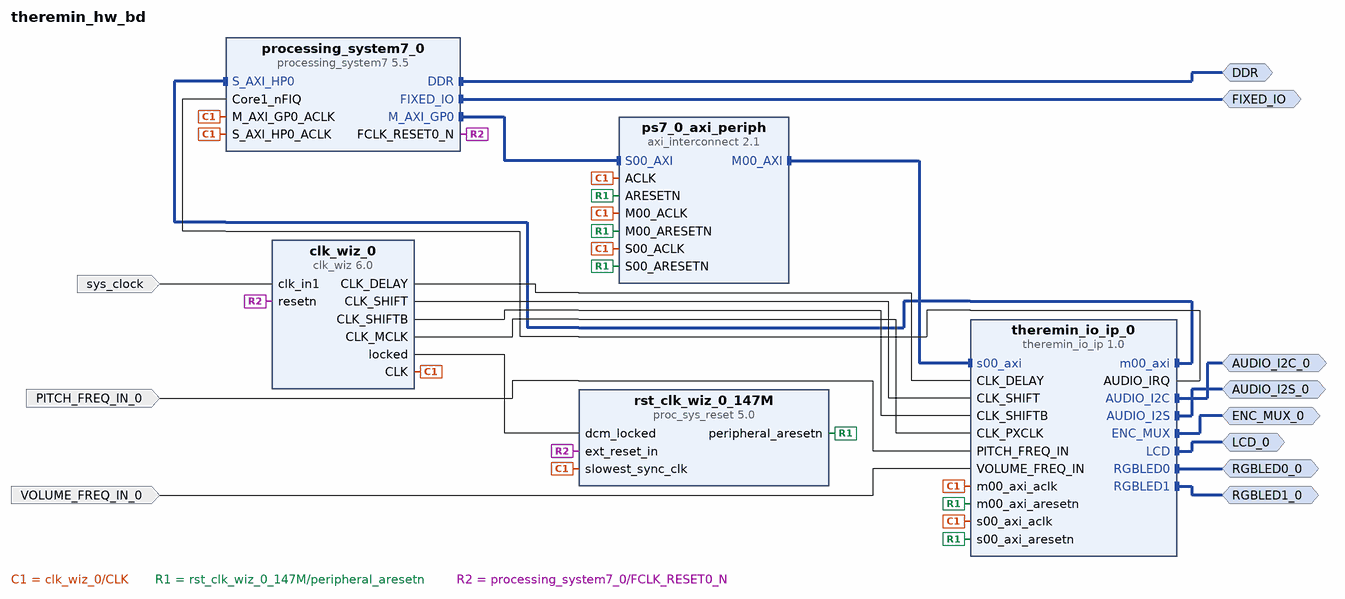
[diagram p0: block diagram of the top level]
# Vivado block design theremin_hw_bd, xc7z010clg400-1, Vivado 2019.1.1
create_bd_design theremin_hw_bd

create_bd_intf_port -mode Master -vlnv xilinx.com:interface:ddrx_rtl:1.0 DDR
create_bd_intf_port -mode Master -vlnv xilinx.com:display_processing_system7:fixedio_rtl:1.0 FIXED_IO
create_bd_intf_port -mode Master -vlnv coolreader.org:user:i2c_rtl:1.0 AUDIO_I2C_0
create_bd_intf_port -mode Master -vlnv coolreader.org:user:input_pin_mux_rtl:1.0 ENC_MUX_0
create_bd_intf_port -mode Master -vlnv coolreader.org:user:lcd_rgb_12bit_rtl:1.0 LCD_0
create_bd_intf_port -mode Master -vlnv coolreader.org:user:i2s_io_rtl:1.0 AUDIO_I2S_0
create_bd_intf_port -mode Master -vlnv coolreader.org:user:rgb_led_rtl:1.0 RGBLED0_0
create_bd_intf_port -mode Master -vlnv coolreader.org:user:rgb_led_rtl:1.0 RGBLED1_0
create_bd_port -dir I -type clk sys_clock
set_property -dict {CONFIG.FREQ_HZ 125000000 CONFIG.PHASE 0.000} [get_bd_ports sys_clock]
create_bd_port -dir I PITCH_FREQ_IN_0
create_bd_port -dir I VOLUME_FREQ_IN_0

create_bd_cell -type ip -vlnv xilinx.com:ip:processing_system7:5.5 processing_system7_0
set_property -dict [list \
  CONFIG.PCW_APU_PERIPHERAL_FREQMHZ 650 \
  CONFIG.PCW_CORE1_FIQ_INTR 1 \
  CONFIG.PCW_CRYSTAL_PERIPHERAL_FREQMHZ 50 \
  CONFIG.PCW_ENET0_ENET0_IO {MIO 16 .. 27} \
  CONFIG.PCW_ENET0_GRP_MDIO_ENABLE 1 \
  CONFIG.PCW_ENET0_GRP_MDIO_IO {MIO 52 .. 53} \
  CONFIG.PCW_ENET0_PERIPHERAL_ENABLE 1 \
  CONFIG.PCW_ENET0_RESET_ENABLE 1 \
  CONFIG.PCW_ENET0_RESET_IO {MIO 9} \
  CONFIG.PCW_ENET_RESET_ENABLE 1 \
  CONFIG.PCW_ENET_RESET_SELECT {Share reset pin} \
  CONFIG.PCW_FPGA0_PERIPHERAL_FREQMHZ 100 \
  CONFIG.PCW_GPIO_MIO_GPIO_ENABLE 1 \
  CONFIG.PCW_GPIO_MIO_GPIO_IO MIO \
  CONFIG.PCW_I2C_RESET_ENABLE 1 \
  CONFIG.PCW_PRESET_BANK1_VOLTAGE {LVCMOS 1.8V} \
  CONFIG.PCW_QSPI_PERIPHERAL_ENABLE 0 \
  CONFIG.PCW_SD0_GRP_CD_ENABLE 1 \
  CONFIG.PCW_SD0_GRP_CD_IO {MIO 47} \
  CONFIG.PCW_SD0_GRP_WP_ENABLE 0 \
  CONFIG.PCW_SD0_PERIPHERAL_ENABLE 1 \
  CONFIG.PCW_SD0_SD0_IO {MIO 40 .. 45} \
  CONFIG.PCW_SDIO_PERIPHERAL_FREQMHZ 100 \
  CONFIG.PCW_S_AXI_HP0_DATA_WIDTH 32 \
  CONFIG.PCW_UART0_BAUD_RATE 921600 \
  CONFIG.PCW_UART0_PERIPHERAL_ENABLE 1 \
  CONFIG.PCW_UART0_UART0_IO {MIO 14 .. 15} \
  CONFIG.PCW_UART_PERIPHERAL_FREQMHZ 100 \
  CONFIG.PCW_UIPARAM_DDR_BUS_WIDTH {16 Bit} \
  CONFIG.PCW_UIPARAM_DDR_FREQ_MHZ 525 \
  CONFIG.PCW_UIPARAM_DDR_PARTNO {MT41K256M16 RE-125} \
  CONFIG.PCW_USB0_PERIPHERAL_ENABLE 1 \
  CONFIG.PCW_USB0_RESET_ENABLE 1 \
  CONFIG.PCW_USB0_RESET_IO {MIO 46} \
  CONFIG.PCW_USB0_USB0_IO {MIO 28 .. 39} \
  CONFIG.PCW_USB_RESET_ENABLE 1 \
  CONFIG.PCW_USB_RESET_SELECT {Share reset pin} \
  CONFIG.PCW_USE_FABRIC_INTERRUPT 1 \
  CONFIG.PCW_USE_S_AXI_HP0 1 \
] [get_bd_cells processing_system7_0]
# 292 more settings of processing_system7_0 are not shown: defaults, MIO pin electricals, DDR timing, and values the tool derives
create_bd_cell -type ip -vlnv xilinx.com:ip:clk_wiz:6.0 clk_wiz_0
set_property -dict [list \
  CONFIG.CLKOUT1_JITTER 92.486 \
  CONFIG.CLKOUT1_PHASE_ERROR 123.861 \
  CONFIG.CLKOUT1_REQUESTED_OUT_FREQ 589.844 \
  CONFIG.CLKOUT2_JITTER 92.486 \
  CONFIG.CLKOUT2_PHASE_ERROR 123.861 \
  CONFIG.CLKOUT2_REQUESTED_OUT_FREQ 589.844 \
  CONFIG.CLKOUT2_REQUESTED_PHASE 180 \
  CONFIG.CLKOUT2_USED true \
  CONFIG.CLKOUT3_JITTER 111.820 \
  CONFIG.CLKOUT3_PHASE_ERROR 123.861 \
  CONFIG.CLKOUT3_REQUESTED_OUT_FREQ 200.000 \
  CONFIG.CLKOUT3_USED true \
  CONFIG.CLKOUT4_JITTER 117.580 \
  CONFIG.CLKOUT4_PHASE_ERROR 123.861 \
  CONFIG.CLKOUT4_REQUESTED_OUT_FREQ 147.461 \
  CONFIG.CLKOUT4_USED true \
  CONFIG.CLKOUT5_JITTER 155.334 \
  CONFIG.CLKOUT5_PHASE_ERROR 123.861 \
  CONFIG.CLKOUT5_REQUESTED_OUT_FREQ 36.86525 \
  CONFIG.CLKOUT5_USED true \
  CONFIG.CLKOUT6_JITTER 183.854 \
  CONFIG.CLKOUT6_PHASE_ERROR 123.861 \
  CONFIG.CLKOUT6_REQUESTED_OUT_FREQ 18.432625 \
  CONFIG.CLKOUT6_USED true \
  CONFIG.CLKOUT7_JITTER 211.190 \
  CONFIG.CLKOUT7_PHASE_ERROR 123.861 \
  CONFIG.CLKOUT7_REQUESTED_OUT_FREQ 9.216 \
  CONFIG.CLKOUT7_USED true \
  CONFIG.CLK_IN1_BOARD_INTERFACE sys_clock \
  CONFIG.CLK_OUT1_PORT CLK_SHIFT \
  CONFIG.CLK_OUT2_PORT CLK_SHIFTB \
  CONFIG.CLK_OUT3_PORT CLK_DELAY \
  CONFIG.CLK_OUT4_PORT CLK \
  CONFIG.CLK_OUT5_PORT CLK_PXCLK \
  CONFIG.CLK_OUT6_PORT CLK_MCLK \
  CONFIG.CLK_OUT7_PORT CLK_10 \
  CONFIG.MMCM_CLKFBOUT_MULT_F 18.875 \
  CONFIG.MMCM_CLKOUT0_DIVIDE_F 2.000 \
  CONFIG.MMCM_CLKOUT1_DIVIDE 2 \
  CONFIG.MMCM_CLKOUT1_PHASE 180.000 \
  CONFIG.MMCM_CLKOUT2_DIVIDE 6 \
  CONFIG.MMCM_CLKOUT3_DIVIDE 8 \
  CONFIG.MMCM_CLKOUT4_DIVIDE 32 \
  CONFIG.MMCM_CLKOUT5_DIVIDE 64 \
  CONFIG.MMCM_CLKOUT6_DIVIDE 128 \
  CONFIG.MMCM_DIVCLK_DIVIDE 2 \
  CONFIG.NUM_OUT_CLKS 7 \
  CONFIG.RESET_PORT resetn \
  CONFIG.RESET_TYPE ACTIVE_LOW \
  CONFIG.USE_BOARD_FLOW true \
] [get_bd_cells clk_wiz_0]
create_bd_cell -type ip -vlnv xilinx.com:ip:proc_sys_reset:5.0 rst_clk_wiz_0_147M
create_bd_cell -type ip -vlnv xilinx.com:ip:axi_interconnect:2.1 ps7_0_axi_periph
set_property -dict {CONFIG.ENABLE_ADVANCED_OPTIONS 0 CONFIG.NUM_MI 1} [get_bd_cells ps7_0_axi_periph]
create_bd_cell -type ip -vlnv coolreader_org:user:theremin_io_ip:1.0 theremin_io_ip_0
set_property -dict [list \
  CONFIG.BURST_SIZE 8 \
  CONFIG.DE_POLARITY 1 \
  CONFIG.HBP 46 \
  CONFIG.HFP 4 \
  CONFIG.HSW 29 \
  CONFIG.HSYNC_POLARITY 1 \
  CONFIG.VBP 23 \
  CONFIG.VFP 22 \
  CONFIG.VSW 9 \
  CONFIG.VSYNC_POLARITY 1 \
] [get_bd_cells theremin_io_ip_0]

# ---- connections ----

connect_bd_intf_net [get_bd_intf_ports DDR] [get_bd_intf_pins processing_system7_0/DDR]
connect_bd_intf_net [get_bd_intf_ports RGBLED0_0] [get_bd_intf_pins theremin_io_ip_0/RGBLED0]
connect_bd_intf_net [get_bd_intf_ports FIXED_IO] [get_bd_intf_pins processing_system7_0/FIXED_IO]
connect_bd_intf_net [get_bd_intf_pins theremin_io_ip_0/m00_axi] [get_bd_intf_pins processing_system7_0/S_AXI_HP0]
connect_bd_intf_net [get_bd_intf_pins ps7_0_axi_periph/M00_AXI] [get_bd_intf_pins theremin_io_ip_0/s00_axi]
connect_bd_intf_net [get_bd_intf_ports RGBLED1_0] [get_bd_intf_pins theremin_io_ip_0/RGBLED1]
connect_bd_intf_net [get_bd_intf_ports AUDIO_I2S_0] [get_bd_intf_pins theremin_io_ip_0/AUDIO_I2S]
connect_bd_intf_net [get_bd_intf_pins processing_system7_0/M_AXI_GP0] [get_bd_intf_pins ps7_0_axi_periph/S00_AXI]
connect_bd_intf_net [get_bd_intf_ports AUDIO_I2C_0] [get_bd_intf_pins theremin_io_ip_0/AUDIO_I2C]
connect_bd_intf_net [get_bd_intf_ports ENC_MUX_0] [get_bd_intf_pins theremin_io_ip_0/ENC_MUX]
connect_bd_intf_net [get_bd_intf_ports LCD_0] [get_bd_intf_pins theremin_io_ip_0/LCD]
connect_bd_net [get_bd_ports sys_clock] [get_bd_pins clk_wiz_0/clk_in1]
connect_bd_net [get_bd_pins clk_wiz_0/CLK] \
  [get_bd_pins processing_system7_0/S_AXI_HP0_ACLK] [get_bd_pins ps7_0_axi_periph/ACLK] \
  [get_bd_pins processing_system7_0/M_AXI_GP0_ACLK] [get_bd_pins ps7_0_axi_periph/S00_ACLK] \
  [get_bd_pins ps7_0_axi_periph/M00_ACLK] [get_bd_pins rst_clk_wiz_0_147M/slowest_sync_clk] \
  [get_bd_pins theremin_io_ip_0/s00_axi_aclk] [get_bd_pins theremin_io_ip_0/m00_axi_aclk]
connect_bd_net [get_bd_pins clk_wiz_0/locked] [get_bd_pins rst_clk_wiz_0_147M/dcm_locked]
connect_bd_net [get_bd_pins rst_clk_wiz_0_147M/peripheral_aresetn] \
  [get_bd_pins ps7_0_axi_periph/S00_ARESETN] [get_bd_pins ps7_0_axi_periph/M00_ARESETN] \
  [get_bd_pins ps7_0_axi_periph/ARESETN] [get_bd_pins theremin_io_ip_0/s00_axi_aresetn] \
  [get_bd_pins theremin_io_ip_0/m00_axi_aresetn]
connect_bd_net [get_bd_pins clk_wiz_0/CLK_DELAY] [get_bd_pins theremin_io_ip_0/CLK_DELAY]
connect_bd_net [get_bd_pins clk_wiz_0/CLK_SHIFT] [get_bd_pins theremin_io_ip_0/CLK_SHIFT]
connect_bd_net [get_bd_pins clk_wiz_0/CLK_SHIFTB] [get_bd_pins theremin_io_ip_0/CLK_SHIFTB]
connect_bd_net -net PITCH_FREQ_IN_0_1 [get_bd_ports PITCH_FREQ_IN_0] [get_bd_pins theremin_io_ip_0/PITCH_FREQ_IN]
connect_bd_net -net VOLUME_FREQ_IN_0_1 [get_bd_ports VOLUME_FREQ_IN_0] [get_bd_pins theremin_io_ip_0/VOLUME_FREQ_IN]
connect_bd_net [get_bd_pins processing_system7_0/FCLK_RESET0_N] [get_bd_pins clk_wiz_0/resetn] [get_bd_pins rst_clk_wiz_0_147M/ext_reset_in]
connect_bd_net [get_bd_pins theremin_io_ip_0/AUDIO_IRQ] [get_bd_pins processing_system7_0/Core1_nFIQ]
connect_bd_net [get_bd_pins clk_wiz_0/CLK_MCLK] [get_bd_pins theremin_io_ip_0/CLK_PXCLK]

# ---- address map ----
assign_bd_address -offset 0x43C00000 -range 64K -target_address_space [get_bd_addr_spaces processing_system7_0/Data] [get_bd_addr_segs theremin_io_ip_0/s00_axi/THEREMIN_IP_REGS]
assign_bd_address -offset 0x00000000 -range 512M -target_address_space [get_bd_addr_spaces theremin_io_ip_0/m00_axi] [get_bd_addr_segs processing_system7_0/S_AXI_HP0/HP0_DDR_LOWOCM]

validate_bd_design
save_bd_design
